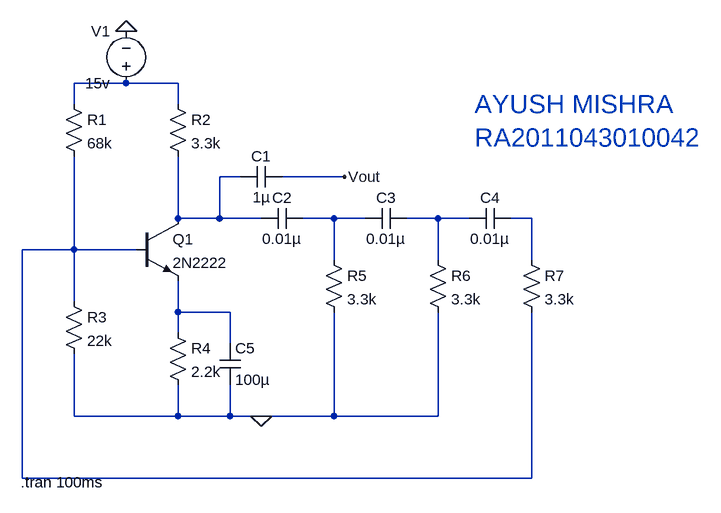
[diagram p0: schematic exp 4.asc]
exp 4.asc, the LTspice schematic file:
Version 4
SHEET 1 1072 680
WIRE 160 32 80 32
WIRE 240 32 160 32
WIRE 80 64 80 32
WIRE 240 64 240 32
WIRE 336 176 304 176
WIRE 496 176 400 176
WIRE 240 240 240 144
WIRE 304 240 304 176
WIRE 304 240 240 240
WIRE 368 240 304 240
WIRE 480 240 432 240
WIRE 528 240 480 240
WIRE 640 240 592 240
WIRE 688 240 640 240
WIRE 784 240 752 240
WIRE 80 288 80 144
WIRE 80 288 0 288
WIRE 176 288 80 288
WIRE 480 304 480 240
WIRE 640 304 640 240
WIRE 784 304 784 240
WIRE 80 368 80 288
WIRE 240 384 240 336
WIRE 320 384 240 384
WIRE 240 416 240 384
WIRE 320 432 320 384
WIRE 80 544 80 448
WIRE 240 544 240 496
WIRE 240 544 80 544
WIRE 320 544 320 496
WIRE 320 544 240 544
WIRE 368 544 320 544
WIRE 480 544 480 384
WIRE 480 544 368 544
WIRE 640 544 640 384
WIRE 640 544 480 544
WIRE 0 640 0 288
WIRE 784 640 784 384
WIRE 784 640 0 640
FLAG 160 -48 0
FLAG 368 544 0
FLAG 496 176 Vout
SYMBOL res 64 48 R0
SYMATTR InstName R1
SYMATTR Value 68k
SYMBOL res 224 48 R0
SYMATTR InstName R2
SYMATTR Value 3.3k
SYMBOL res 224 400 R0
SYMATTR InstName R4
SYMATTR Value 2.2k
SYMBOL npn 176 240 R0
SYMATTR InstName Q1
SYMATTR Value 2N2222
SYMBOL cap 400 160 R90
WINDOW 0 0 32 VBottom 2
WINDOW 3 32 32 VTop 2
SYMATTR InstName C1
SYMATTR Value 1µ
SYMBOL cap 432 224 R90
WINDOW 0 0 32 VBottom 2
WINDOW 3 32 32 VTop 2
SYMATTR InstName C2
SYMATTR Value 0.01µ
SYMBOL cap 592 224 R90
WINDOW 0 0 32 VBottom 2
WINDOW 3 32 32 VTop 2
SYMATTR InstName C3
SYMATTR Value 0.01µ
SYMBOL cap 752 224 R90
WINDOW 0 0 32 VBottom 2
WINDOW 3 32 32 VTop 2
SYMATTR InstName C4
SYMATTR Value 0.01µ
SYMBOL res 464 288 R0
SYMATTR InstName R5
SYMATTR Value 3.3k
SYMBOL res 624 288 R0
SYMATTR InstName R6
SYMATTR Value 3.3k
SYMBOL res 768 288 R0
SYMATTR InstName R7
SYMATTR Value 3.3k
SYMBOL voltage 160 48 R180
WINDOW 0 24 96 Left 2
WINDOW 3 24 16 Left 2
WINDOW 123 0 0 Left 0
WINDOW 39 0 0 Left 0
SYMATTR InstName V1
SYMATTR Value 15v
SYMBOL res 64 352 R0
SYMATTR InstName R3
SYMATTR Value 22k
SYMBOL cap 304 432 R0
SYMATTR InstName C5
SYMATTR Value 100µ
TEXT -2 646 Left 2 !.tran 100ms
TEXT 696 64 Left 4 ;AYUSH MISHRA \nRA2011043010042

The netlist it stands for:
* exp 4.asc
R1 N001 N006 68k
R2 N001 N002 3.3k
R4 N007 0 2.2k
Q1 N002 N006 N007 0 2N2222
C1 Vout N002 1µ
C2 N003 N002 0.01µ
C3 N004 N003 0.01µ
C4 N005 N004 0.01µ
R5 N003 0 3.3k
R6 N004 0 3.3k
R7 N005 N006 3.3k
V1 N001 0 15v
R3 N006 0 22k
C5 N007 0 100µ
.model NPN NPN
.model PNP PNP
.lib standard.bjt
.tran 100ms
* AYUSH MISHRA
* RA2011043010042
.backanno
.end